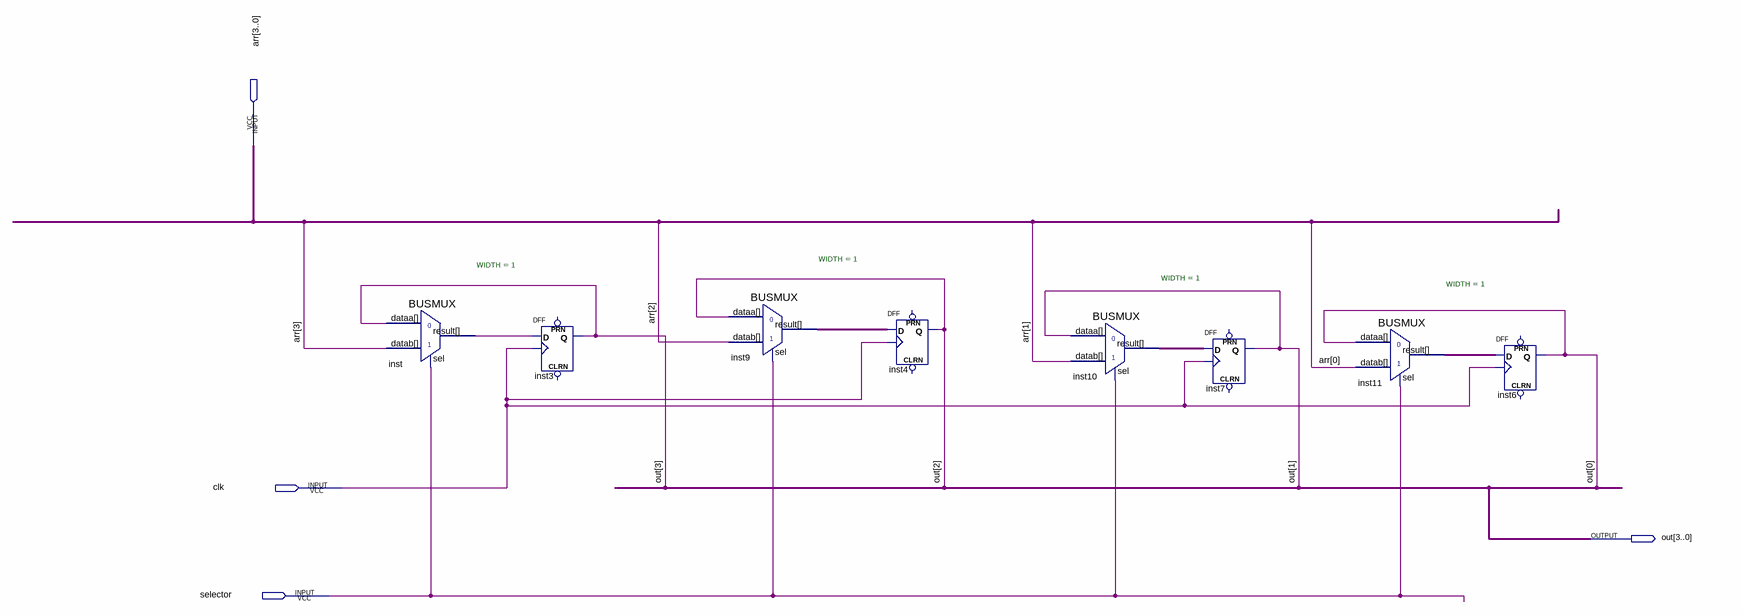
[diagram p0: schematic sheet]
// Quartus schematic Reg.bdf as structural Verilog: 8 symbols, 4 pins
module Reg (
  input  [3:0] arr,
  input  clk,
  input  selector,
  output [3:0] out
);

  wire inst9_result, inst10_result, inst11_result, inst_result;

  BUSMUX #(.WIDTH(1)) inst (.datab(arr[3]), .sel(selector), .dataa(out[3]), .result(inst_result));
  DFF inst3 (.CLK(clk), .D(inst_result), .Q(out[3]));  // open: CLRN, PRN
  BUSMUX #(.WIDTH(1)) inst9 (.datab(arr[2]), .sel(selector), .dataa(out[2]), .result(inst9_result));
  DFF inst4 (.CLK(clk), .D(inst9_result), .Q(out[2]));  // open: CLRN, PRN
  BUSMUX #(.WIDTH(1)) inst10 (.datab(arr[1]), .sel(selector), .dataa(out[1]), .result(inst10_result));
  DFF inst7 (.CLK(clk), .D(inst10_result), .Q(out[1]));  // open: CLRN, PRN
  BUSMUX #(.WIDTH(1)) inst11 (.datab(arr[0]), .sel(selector), .dataa(out[0]), .result(inst11_result));
  DFF inst6 (.CLK(clk), .D(inst11_result), .Q(out[0]));  // open: CLRN, PRN
endmodule
